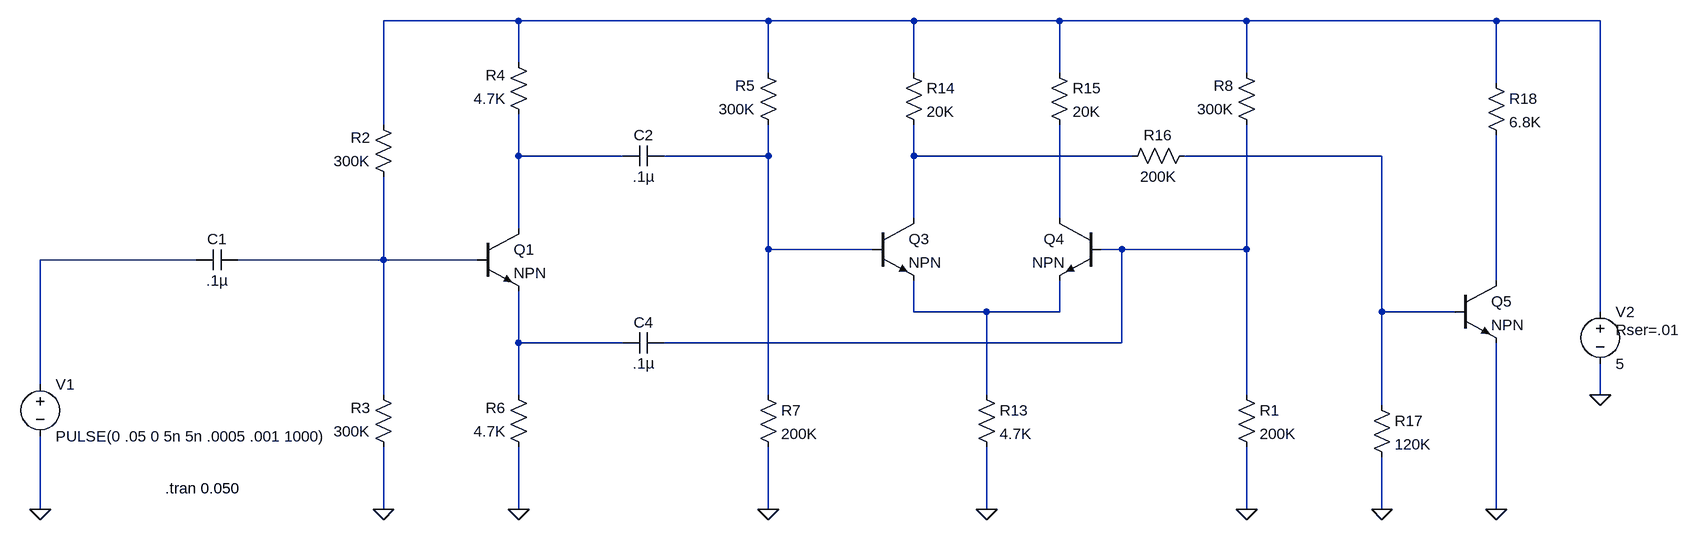
[diagram p0: schematic bufferAmp.asc]
bufferAmp.asc, the LTspice schematic file:
Version 4
SHEET 1 2112 680
WIRE -32 -656 -240 -656
WIRE 352 -656 -32 -656
WIRE 576 -656 352 -656
WIRE 800 -656 576 -656
WIRE 1088 -656 800 -656
WIRE 1472 -656 1088 -656
WIRE 1632 -656 1472 -656
WIRE -32 -592 -32 -656
WIRE 352 -576 352 -656
WIRE 576 -576 576 -656
WIRE 800 -576 800 -656
WIRE 1088 -576 1088 -656
WIRE 1472 -560 1472 -656
WIRE -240 -496 -240 -656
WIRE -32 -448 -32 -512
WIRE 128 -448 -32 -448
WIRE 352 -448 352 -496
WIRE 352 -448 192 -448
WIRE 576 -448 576 -496
WIRE 912 -448 576 -448
WIRE 1296 -448 992 -448
WIRE 576 -352 576 -448
WIRE 800 -352 800 -496
WIRE -32 -336 -32 -448
WIRE 352 -304 352 -448
WIRE 512 -304 352 -304
WIRE 896 -304 864 -304
WIRE 1088 -304 1088 -496
WIRE 1088 -304 896 -304
WIRE -528 -288 -768 -288
WIRE -240 -288 -240 -416
WIRE -240 -288 -464 -288
WIRE -96 -288 -240 -288
WIRE 1472 -256 1472 -480
WIRE 576 -208 576 -256
WIRE 688 -208 576 -208
WIRE 800 -208 800 -256
WIRE 800 -208 688 -208
WIRE 1296 -208 1296 -448
WIRE 1408 -208 1296 -208
WIRE 1632 -208 1632 -656
WIRE -32 -160 -32 -240
WIRE 128 -160 -32 -160
WIRE 896 -160 896 -304
WIRE 896 -160 192 -160
WIRE -768 -96 -768 -288
WIRE -240 -80 -240 -288
WIRE -32 -80 -32 -160
WIRE 352 -80 352 -304
WIRE 688 -80 688 -208
WIRE 1088 -80 1088 -304
WIRE 1632 -80 1632 -128
WIRE 1296 -64 1296 -208
WIRE -768 96 -768 -16
WIRE -240 96 -240 0
WIRE -32 96 -32 0
WIRE 352 96 352 0
WIRE 688 96 688 0
WIRE 1088 96 1088 0
WIRE 1296 96 1296 16
WIRE 1472 96 1472 -160
FLAG -240 96 0
FLAG -768 96 0
FLAG -32 96 0
FLAG 688 96 0
FLAG 1296 96 0
FLAG 1472 96 0
FLAG 1632 -80 0
FLAG 352 96 0
FLAG 1088 96 0
SYMBOL res -224 -400 R180
WINDOW 0 36 76 Left 2
WINDOW 3 36 40 Left 2
SYMATTR InstName R2
SYMATTR Value 300K
SYMBOL res -224 16 R180
WINDOW 0 36 76 Left 2
WINDOW 3 36 40 Left 2
SYMATTR InstName R3
SYMATTR Value 300K
SYMBOL res -16 -496 R180
WINDOW 0 36 76 Left 2
WINDOW 3 36 40 Left 2
SYMATTR InstName R4
SYMATTR Value 4.7K
SYMBOL res -16 16 R180
WINDOW 0 36 76 Left 2
WINDOW 3 36 40 Left 2
SYMATTR InstName R6
SYMATTR Value 4.7K
SYMBOL npn -96 -336 R0
SYMATTR InstName Q1
SYMBOL npn 512 -352 R0
SYMATTR InstName Q3
SYMBOL npn 864 -352 M0
SYMATTR InstName Q4
SYMBOL npn 1408 -256 R0
SYMATTR InstName Q5
SYMBOL voltage -768 -112 R0
WINDOW 123 0 0 Left 2
WINDOW 39 0 0 Left 2
SYMATTR InstName V1
SYMATTR Value PULSE(0 .05 0 5n 5n .0005 .001 1000)
SYMBOL voltage 1632 -224 R0
WINDOW 123 0 0 Left 2
WINDOW 39 24 44 Left 2
SYMATTR SpiceLine Rser=.01
SYMATTR InstName V2
SYMATTR Value 5
SYMBOL res 672 -96 R0
SYMATTR InstName R13
SYMATTR Value 4.7K
SYMBOL res 560 -592 R0
SYMATTR InstName R14
SYMATTR Value 20K
SYMBOL res 784 -592 R0
SYMATTR InstName R15
SYMATTR Value 20K
SYMBOL res 1008 -464 R90
WINDOW 0 0 56 VBottom 2
WINDOW 3 32 56 VTop 2
SYMATTR InstName R16
SYMATTR Value 200K
SYMBOL res 1280 -80 R0
SYMATTR InstName R17
SYMATTR Value 120K
SYMBOL res 1456 -576 R0
SYMATTR InstName R18
SYMATTR Value 6.8K
SYMBOL cap -464 -304 R90
WINDOW 0 0 32 VBottom 2
WINDOW 3 32 32 VTop 2
SYMATTR InstName C1
SYMATTR Value .1µ
SYMBOL cap 192 -176 R90
WINDOW 0 0 32 VBottom 2
WINDOW 3 32 32 VTop 2
SYMATTR InstName C4
SYMATTR Value .1µ
SYMBOL cap 192 -464 R90
WINDOW 0 0 32 VBottom 2
WINDOW 3 32 32 VTop 2
SYMATTR InstName C2
SYMATTR Value .1µ
SYMBOL res 336 -96 R0
SYMATTR InstName R7
SYMATTR Value 200K
SYMBOL res 368 -480 R180
WINDOW 0 36 76 Left 2
WINDOW 3 36 40 Left 2
SYMATTR InstName R5
SYMATTR Value 300K
SYMBOL res 1072 -96 R0
SYMATTR InstName R1
SYMATTR Value 200K
SYMBOL res 1104 -480 R180
WINDOW 0 36 76 Left 2
WINDOW 3 36 40 Left 2
SYMATTR InstName R8
SYMATTR Value 300K
TEXT -576 64 Left 2 !.tran 0.050

The netlist it stands for:
* bufferAmp.asc
R2 N009 N001 300K
R3 0 N009 300K
R4 N002 N001 4.7K
R6 0 N012 4.7K
Q1 N002 N009 N012 0 NPN
Q3 N004 N003 N011 0 NPN
Q4 N006 N007 N011 0 NPN
Q5 N010 N005 0 0 NPN
V1 N008 0 PULSE(0 .05 0 5n 5n .0005 .001 1000)
V2 N001 0 5 Rser=.01
R13 N011 0 4.7K
R14 N001 N004 20K
R15 N001 N006 20K
R16 N005 N004 200K
R17 N005 0 120K
R18 N001 N010 6.8K
C1 N009 N008 .1µ
C4 N007 N012 .1µ
C2 N003 N002 .1µ
R7 N003 0 200K
R5 N003 N001 300K
R1 N007 0 200K
R8 N007 N001 300K
.model NPN NPN
.model PNP PNP
.lib standard.bjt
.tran 0.050
.backanno
.end